# Altium schematic sheet [10] BUTTONS.SchDoc
size A4
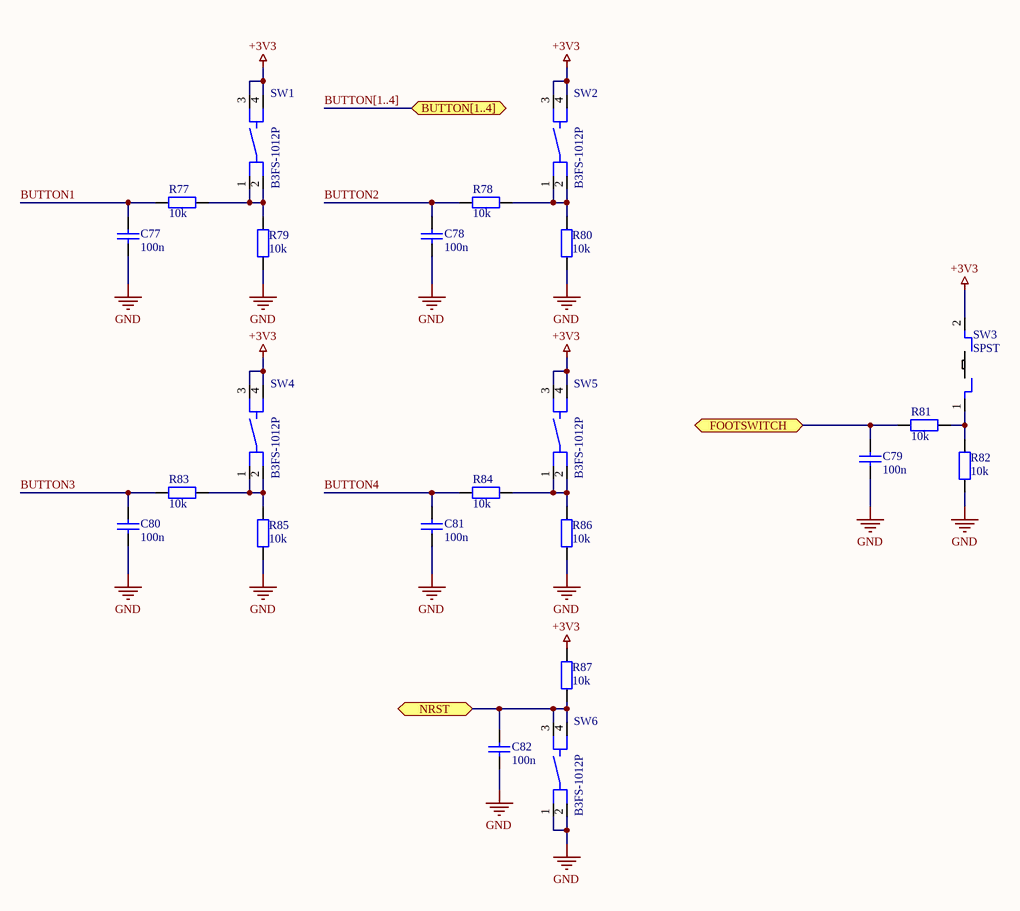
[diagram p0: [10] BUTTONS.SchDoc]

## Parts
C77  100n  [Capacitor 0603]
C78  100n  [Capacitor 0603]
C79  100n  [Capacitor 0603]
C80  100n  [Capacitor 0603]
C81  100n  [Capacitor 0603]
C82  100n  [Capacitor 0603]
R77  10k  [Resistor 0603]
R78  10k  [Resistor 0603]
R79  10k  [Resistor 0603]
R80  10k  [Resistor 0603]
R81  10k  [Resistor 0603]
R82  10k  [Resistor 0603]
R83  10k  [Resistor 0603]
R84  10k  [Resistor 0603]
R85  10k  [Resistor 0603]
R86  10k  [Resistor 0603]
R87  10k  [Resistor 0603]
SW1  B3FS-1012P  [Mechanical Tacitile 6x6]
SW2  B3FS-1012P  [Mechanical Tacitile 6x6]
SW3  SPST  [Mechanical footswitch SPST]
SW4  B3FS-1012P  [Mechanical Tacitile 6x6]
SW5  B3FS-1012P  [Mechanical Tacitile 6x6]
SW6  B3FS-1012P  [Mechanical Tacitile 6x6]

## Ports
BUTTON[1..4] (bidir), FOOTSWITCH (bidir), NRST (bidir)

## Nets
+3V3: R87.2 SW1.3 SW1.4 SW2.3 SW2.4 SW3.2 SW4.3 SW4.4 SW5.3 SW5.4
GND: C77.1 C78.1 C79.1 C80.1 C81.1 C82.1 R79.1 R80.1 R82.1 R85.1 R86.1 SW6.1 SW6.2
BUTTON1: C77.2 R77.2
BUTTON2: C78.2 R78.2
BUTTON3: C80.2 R83.2
BUTTON4: C81.2 R84.2
FOOTSWITCH: C79.2 R81.2 ; port FOOTSWITCH
NRST: C82.2 R87.1 SW6.3 SW6.4 ; port NRST
NetR77_1: R77.1 R79.2 SW1.1 SW1.2
NetR78_1: R78.1 R80.2 SW2.1 SW2.2
NetR81_1: R81.1 R82.2 SW3.1
NetR83_1: R83.1 R85.2 SW4.1 SW4.2
NetR84_1: R84.1 R86.2 SW5.1 SW5.2

## Buses and harness runs
bus BUTTON[1..4] = port BUTTON[1..4]

## Library data of the parts
C77-C82 = Capacitor 100n 10% 0603 EMK107B7104KA-T: Multilayer Ceramic Capacitors MLCC - SMD/SMT 0603 16VDC 0.1uF 10% X7R; Manufacturer: Taiyo Yuden; Type: SMD; Manufacturer Part Number: EMK107B7104KA-T; Footprint: 0603; Datasheet: https://pl.mouser.com/datasheet/2/396/mlcc02_e-1307760.pdf
R77-R87 = Resistor 10k 1% 0603 RT0603FRE0710KL: Thin Film Resistors - SMD 10K ohm 1% 1/10W; Manufacturer: Yageo; Manufacturer Part Number: RT0603FRE0710KL; Footprint: 0603; Type: SMD; Datasheet: https://pl.mouser.com/datasheet/2/447/PYu_RT_1_to_0_01_RoHS_L_11-1669912.pdf
SW1 SW2 SW4-SW6 = Mechanical Tactile Switches Tactile Switch B3FS-1012P: Tactile Switches Tactile Switch; Manufacturer: Omron Electronics; Manufacturer Part Number: B3FS-1012P; Footprint: 6 mm x 6 mm; Type: SMD; Datasheet: https://pl.mouser.com/datasheet/2/307/omron_B3FS-1189765.pdf
SW3 = Mechanical Pushbutton Switches SP ON-OFF SOLDER LUG: Pushbutton Switches SP ON-OFF SOLDER LUG; Manufacturer Part Number: 64111210; Manufacturer: Carling Technologies; Footprint: THT; Type: PANEL; Datasheet: https://pl.mouser.com/datasheet/2/65/641-Series_Details__26_COS_020513-225963.pdf